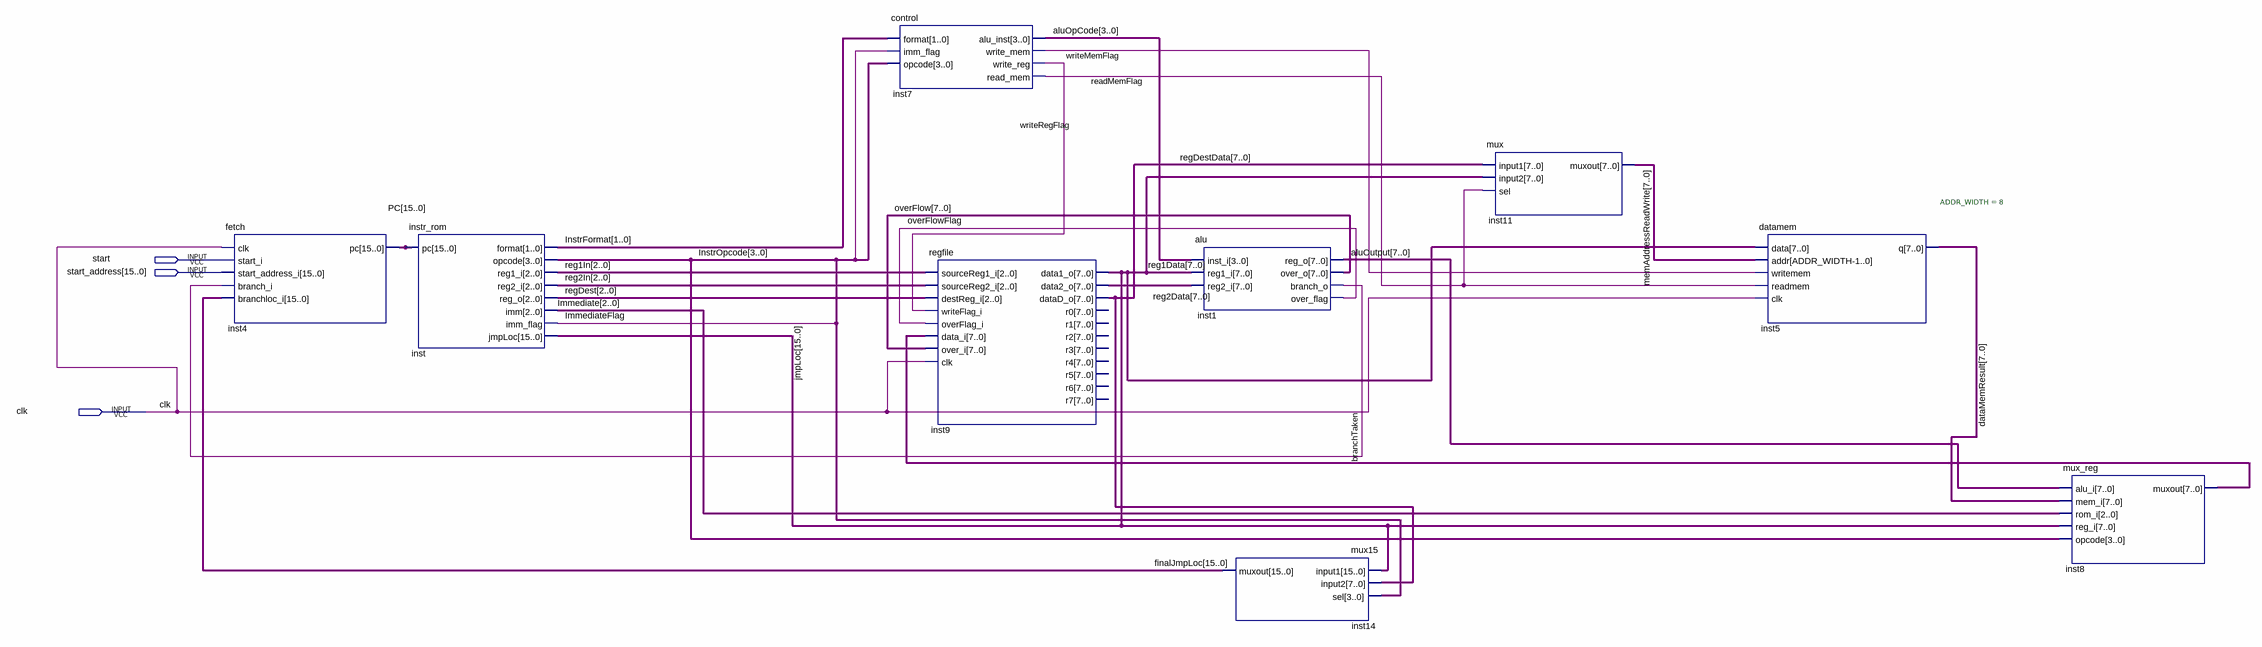
[diagram p0: schematic sheet]
// Quartus schematic pipelinediagram.bdf as structural Verilog: 9 symbols, 3 pins
module pipelinediagram (
  input  start,
  input  [15:0] start_address,
  input  clk
);

  wire branchTaken, ImmediateFlag, overFlowFlag, readMemFlag, undriven, writeMemFlag, writeRegFlag;
  wire [1:0] InstrFormat;
  wire [2:0] Immediate, reg1In, reg2In, regDest;
  wire [3:0] aluOpCode, InstrOpcode;
  wire [7:0] aluOutput, dataMemResult, inst8_muxout, memAddressReadWrite, overFlow, reg1Data, reg2Data,
       regDestData;
  wire [15:0] finalJmpLoc, jmpLoc, PC;

  fetch inst4 (
    .clk(clk), .start_i(start), .start_address_i(start_address), .branch_i(branchTaken),
    .branchloc_i(finalJmpLoc), .pc(PC));
  instr_rom inst (
    .pc(PC), .format(InstrFormat), .opcode(InstrOpcode), .reg1_i(reg1In), .reg2_i(reg2In), .reg_o(regDest),
    .imm(Immediate), .imm_flag(ImmediateFlag), .jmpLoc(jmpLoc));
  control inst7 (
    .format(InstrFormat), .imm_flag(undriven), .opcode(InstrOpcode), .alu_inst(aluOpCode),
    .write_mem(writeMemFlag), .write_reg(writeRegFlag), .read_mem(readMemFlag));
  regfile inst9 (
    .sourceReg1_i(reg1In), .sourceReg2_i(reg2In), .destReg_i(regDest), .writeFlag_i(writeRegFlag),
    .overFlag_i(overFlowFlag), .data_i(inst8_muxout), .over_i(overFlow), .clk(clk), .data1_o(jmpLoc),
    .data2_o(reg2Data), .dataD_o(regDestData));  // open: r0, r1, r2, r3, r4, r5, r6, r7
  alu inst1 (
    .inst_i(aluOpCode), .reg1_i(reg1Data), .reg2_i(reg2Data), .reg_o(aluOutput), .over_o(overFlow),
    .branch_o(branchTaken), .over_flag(overFlowFlag));
  mux15 inst14 (.input1(jmpLoc), .input2(regDestData), .sel(InstrOpcode), .muxout(finalJmpLoc));
  mux inst11 (.input1(regDestData), .input2(jmpLoc), .sel(readMemFlag), .muxout(memAddressReadWrite));
  datamem #(.ADDR_WIDTH(8)) inst5 (
    .data(jmpLoc), .addr(memAddressReadWrite), .writemem(writeMemFlag), .readmem(readMemFlag), .clk(clk),
    .q(dataMemResult));
  mux_reg inst8 (
    .alu_i(aluOutput), .mem_i(dataMemResult), .rom_i(Immediate), .reg_i(jmpLoc), .opcode(InstrOpcode),
    .muxout(inst8_muxout));
endmodule
